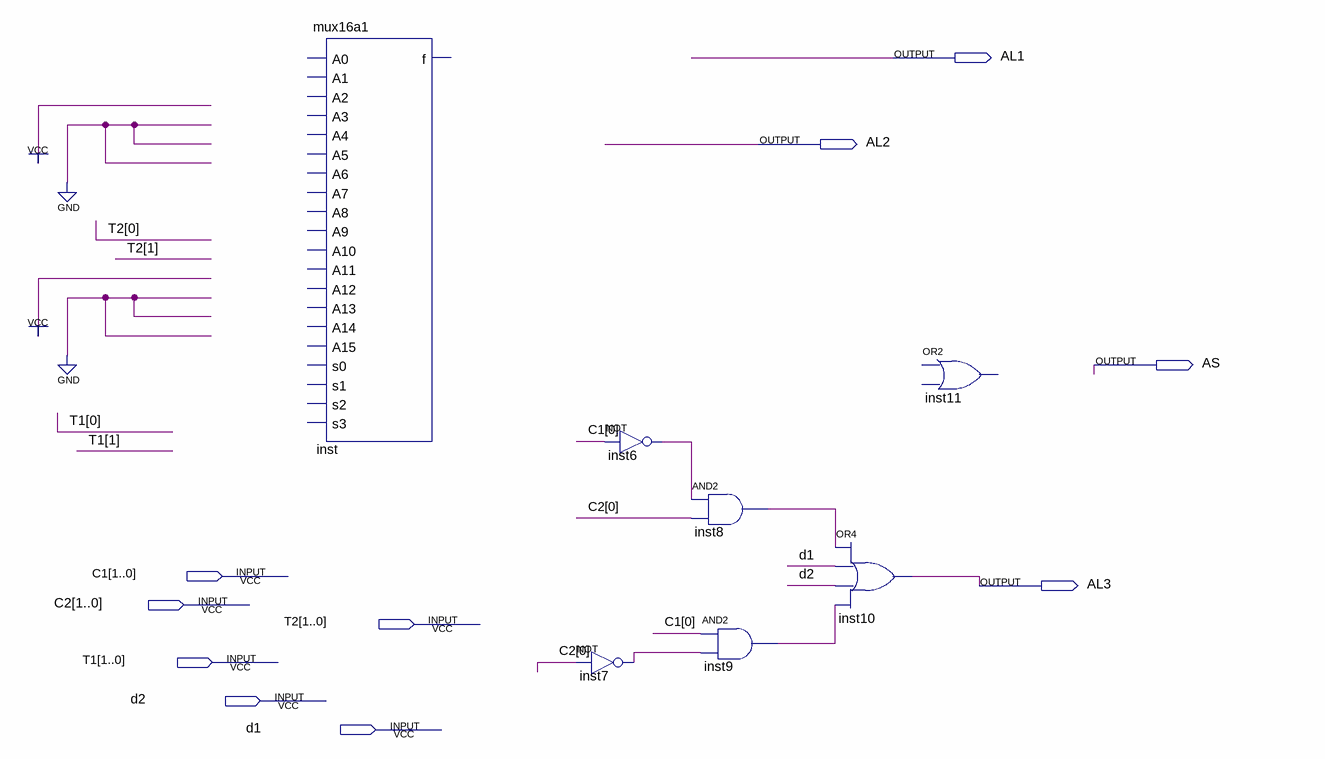
[diagram p0: schematic sheet]
// Quartus schematic Proyecto.bdf as structural Verilog: 7 symbols, 10 pins
module Proyecto (
  input  [1:0] C1,
  input  [1:0] C2,
  input  [1:0] T2,
  input  [1:0] T1,
  input  d2,
  input  d1,
  output AL1,
  output AL2,
  output AS,
  output AL3
);

  wire inst6_out, inst7_out, inst8_out, inst9_out;

  mux16a1 inst ();  // open: A0, A1, A2, A3, A4, A5, A6, A7, A8, A9, A10, A11, A12, A13, A14, A15, s0, s1, s2, s3, f
  not inst6 (inst6_out, C1[0]);
  not inst7 (inst7_out, C2[0]);
  and inst8 (inst8_out, inst6_out, C2[0]);
  and inst9 (inst9_out, C1[0], inst7_out);
  or inst10 (AL3, inst8_out, d1, d2, inst9_out);
  // OR2 inst11 is placed but not wired
endmodule
